# Altium schematic sheet Relay.SchDoc
size A4; SheetNumber: 2; SheetTotal: 2
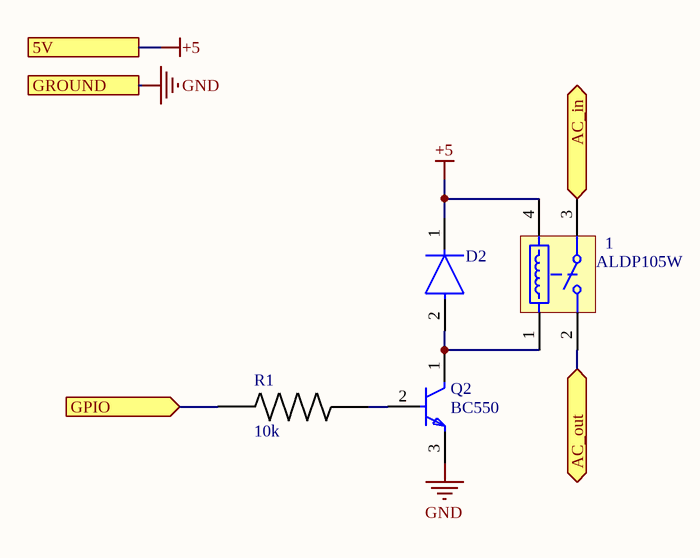
[diagram p0: Relay.SchDoc]

## Parts
1  ALDP105W  [PNSC-LD-P-4-2050x720x1530_V]
D2  1N4001-E3/73  [FP-1N4001-E3-73-MFG]  (value not drawn)
Q2  BC550  [FP-135AN-MFG]
R1  10k  [thd res]

## Ports
5V, AC_in (bidir), AC_out (bidir), GPIO (in), GROUND

## Nets
+5: 1.4 D2.1(C) ; port 5V
GND: Q2.3(E) ; port GROUND
AC_in: 1.3(COM) ; port AC_in
AC_out: 1.2(NO) ; port AC_out
GPIO: R1.1 ; port GPIO
Net1_1: 1.1 D2.2(A) Q2.1(C)
NetQ2_2: Q2.2(B) R1.2

## Library data of the parts
1 = CMP-1503-00163-1: LD-P Relays, 5 V Coil Voltage, 200 mW Nominal Operating Power, -40 to 85 degC, 4-Pin LD-P, Carton, Case, RoHS; Manufacturer: Panasonic; Mechanical Life(Min.operation): 5x10^6; Max Switching Current: 5 A AC, 3 A DC; Pb-Free: True; Electrical Life: 2x10^5; Coil Voltage: 5 V; Max Switching Voltage: 277 V AC, 30 V DC; Nominal Operating Power: 200 mW; ComponentLink3Description: Package Specification; PackageVersion: ASCTB193E, 02/2014; ComponentLink1URL: http://www3.panasonic.biz/ac/ae/index.jsp; Mounting Technology: Through Hole; Packing: Carton, Case; PackageDescription: 4-Pin Through Hole Terminal Package, Body 20.5 x 7.2 mm; ComponentLink2Description: Datasheet; RoHS: True; Series: LD-P Relays; ComponentLink1Description: Manufacturer URL; ComponentLink2URL: http://www3.panasonic.biz/ac/e_download/control/relay/power/catalog/mech_eng_ldp.pdf?f_cd=300242; PartNumber: ALDP105W; DatasheetVersion: 201402-T; PackageReference: LD-P-4-2050x720x1530; ComponentLink3URL: http://www3.panasonic.biz/ac/e_download/control/relay/power/catalog/mech_eng_ldp.pdf?f_cd=300242
D2 = CMP-02540-000001-1: DIODE GEN PURP 50V 1A DO204AL; Manufacturer: Vishay; Max Surge Forward Current: 30A; Value: 15pF; Peak Reverse Current: 5uA; Description: Diode Standard 50V 1A Through Hole DO-204AL (DO-41); Max Junction Temp: +150°C; Lead Free: Yes; Manufacturer Part Number: 1N4001-E3/73; Height: 2.7mm; Digikey Description: DIODE GEN PURP 50V 1A DO204AL; Reverse Voltage: 50V; Package: 1N4001-E3/73; RoHS: TRUE; Temperature: -50°C to +150°C; Device Class L2: Diodes; Forward Current: 1A; Max Repetitive Reverse Voltage: 50V; Device Class L1: Discrete Semiconductors; Device Class L3: Rectifier Diodes; Capacitance: 15pF; Temperature Range High: +150°C; Category: Diode; Ipc Land Pattern Name: DIOPA1088W105L520D270; ComponentLink2URL: http://www.vishay.com/docs/88503/1n4001.pdf; Octopart: https://octopart.com/1n4001-e3%2F73-vishay-42330130; Automotive: No; ComponentLink2Description: Datasheet; Temperature Range Low: -50°C; Mouser Description: Rectifiers Vr/50V Io/1A
Q2 = CMP-00278-13139640-1: BC550 Bulk Through Hole NPN Single Bipolar (BJT) Transistor 110 @ 2mA 5V 100mA 500mW 300MHz; Collector Emitter Saturation Voltage: 250mV; Number of Elements: 1; Collector Base Voltage (VCBO): 50V; hFE Min: 110; Collector Emitter Voltage (VCEO): 45V; Max Junction Temperature (Tj): 150°C; Number of Pins: 3; Mount: Through Hole; NexarPartId: 13139640; Lead Free: Lead Free; Gain Bandwidth Product: 300MHz; Case/Package: TO-92; RoHS: Compliant; REACH SVHC: No SVHC; Polarity: NPN; Frequency: 300MHz; Termination: Through Hole; Voltage Rating (DC): 45V; Power Dissipation: 500mW; Max Collector Current: 100mA; Min Operating Temperature: -65°C; Packaging: Bulk; Transition Frequency: 300MHz; Weight: 201mg; Element Configuration: Single; Current Rating: 100mA; Max Power Dissipation: 500mW; Emitter Base Voltage (VEBO): 5V; Collector Emitter Breakdown Voltage: 45V; Max Operating Temperature: 150°C; Height: 5.33mm
R1 = thd res